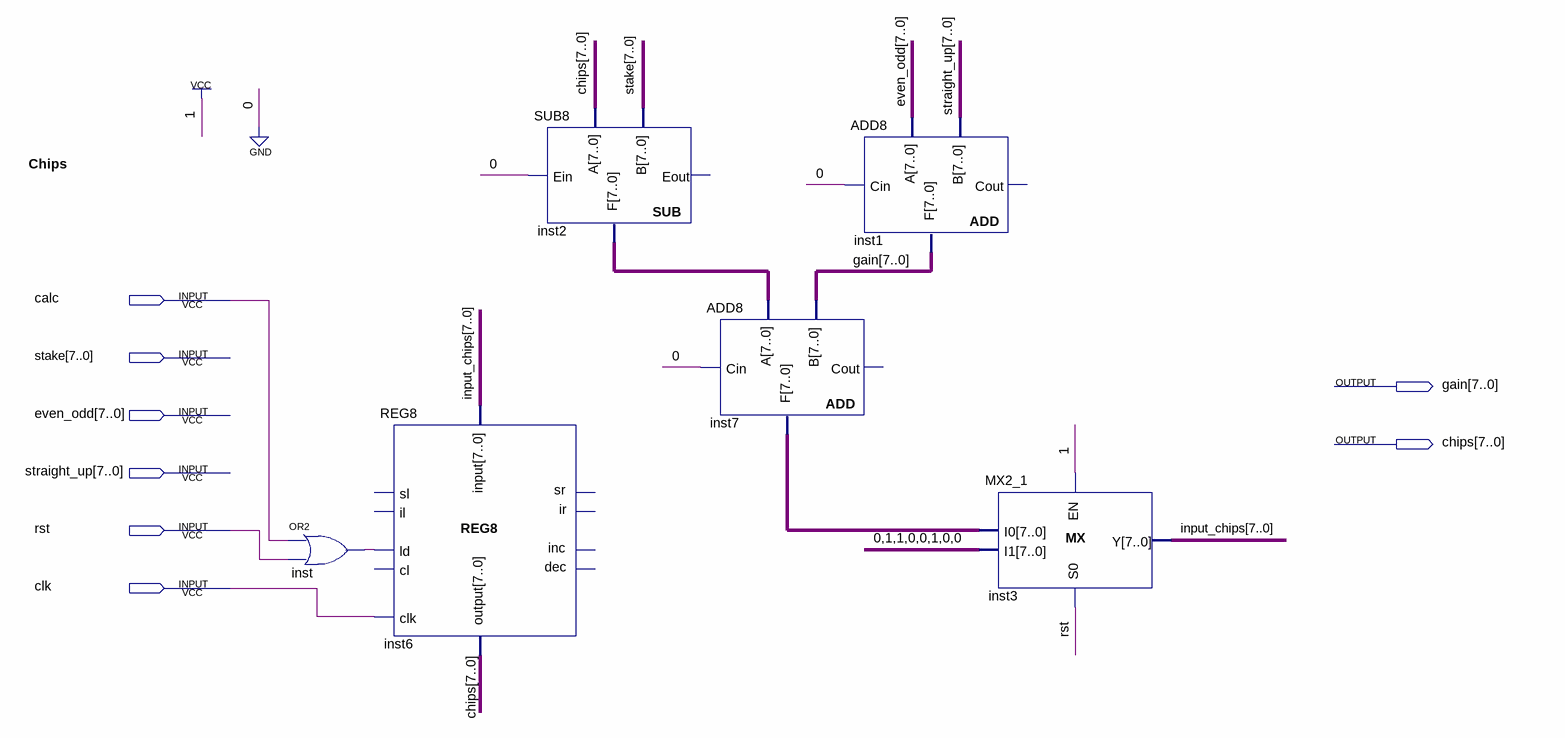
[diagram p0: schematic sheet]
// Quartus schematic Chips.bdf as structural Verilog: 6 symbols, 8 pins
module Chips (
  input  calc,
  input  [7:0] stake,
  input  [7:0] even_odd,
  input  [7:0] straight_up,
  input  rst,
  input  clk,
  output [7:0] gain,
  output [7:0] chips
);

  wire inst_out;
  wire [7:0] input_chips, inst2_f, inst7_f;

  or inst (inst_out, calc, rst);
  REG8 inst6 (.clk(clk), .ld(inst_out), .\input (input_chips), .\output (chips));  // open: sr, ir, sl, il, inc, dec, cl
  SUB8 inst2 (.A(chips), .B(stake), .Ein(1'b0), .F(inst2_f));  // open: Eout
  ADD8 inst7 (.A(inst2_f), .B(gain), .Cin(1'b0), .F(inst7_f));  // open: Cout
  ADD8 inst1 (.A(even_odd), .B(straight_up), .Cin(1'b0), .F(gain));  // open: Cout
  MX2_1 inst3 (.I1(8'b01100100), .I0(inst7_f), .S0(rst), .EN(1'b1), .Y(input_chips));

  // Notes on the sheet:
  //   Chips
endmodule
